# Altium schematic sheet resistors_set.SchDoc
size A4; SheetNumber: 2; SheetTotal: 6
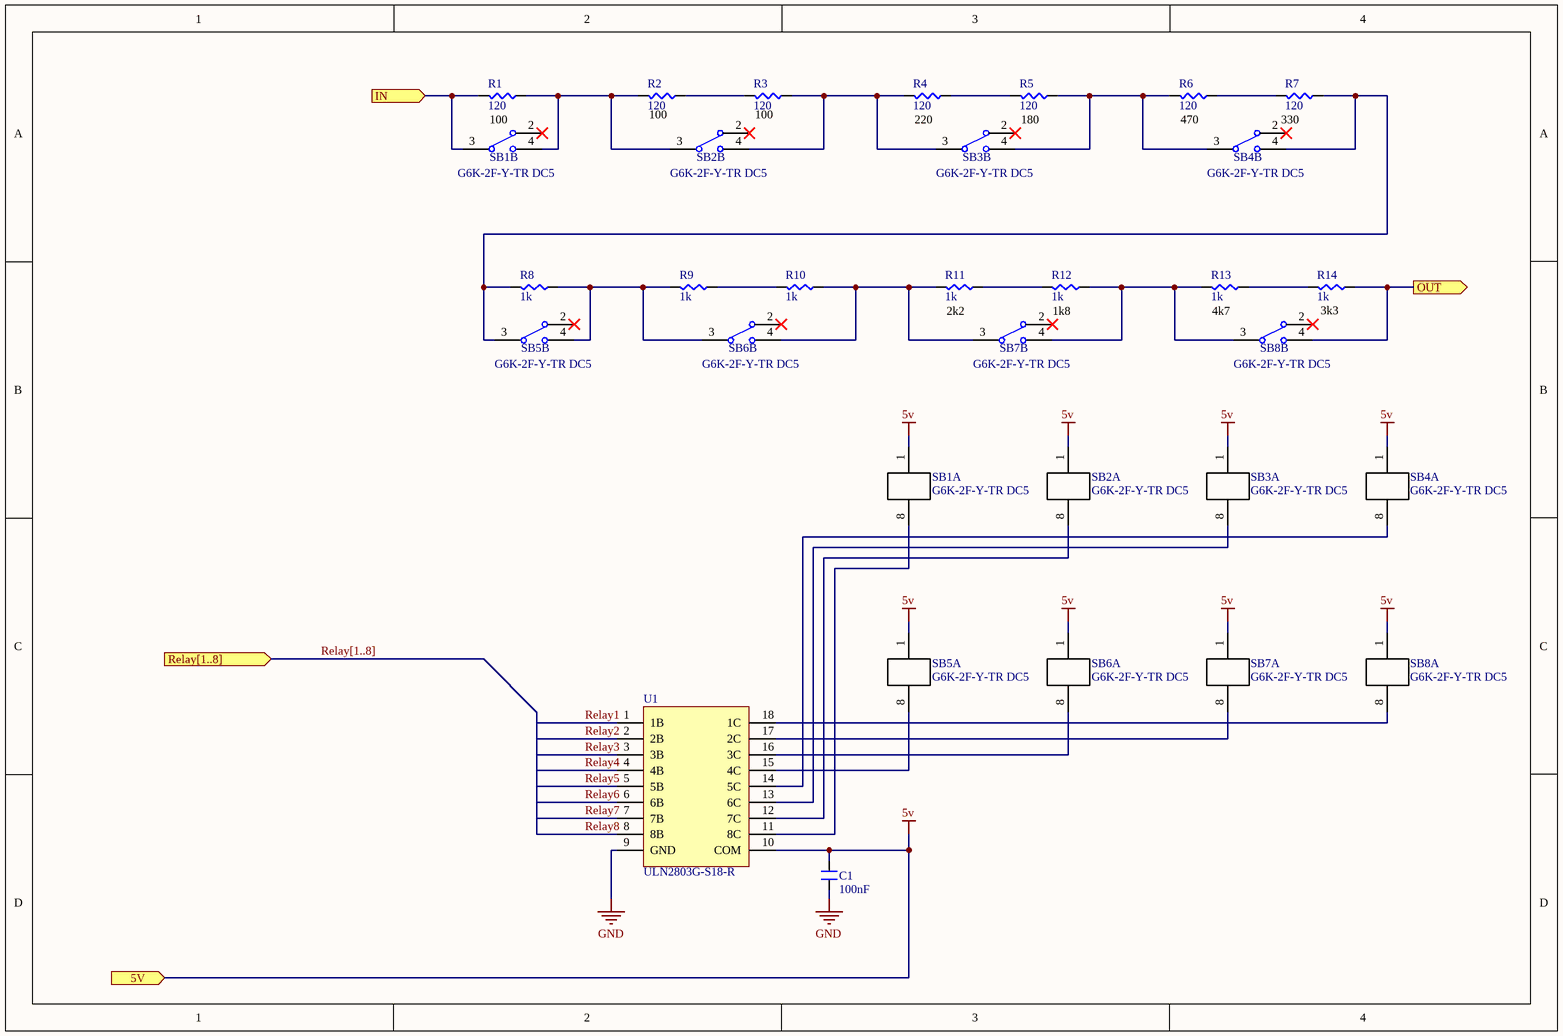
[diagram p0: resistors_set.SchDoc]

## Parts
C1  100nF  [CAP0603]
R1  120  [RES1206]
R2  120  [RES1206]
R3  120  [RES1206]
R4  120  [RES1206]
R5  120  [RES1206]
R6  120  [RES1206]
R7  120  [RES1206]
R8  1k  [RES1206]
R9  1k  [RES1206]
R10  1k  [RES1206]
R11  1k  [RES1206]
R12  1k  [RES1206]
R13  1k  [RES1206]
R14  1k  [RES1206]
SB1  G6K-2F-Y-TR DC5  [Omron_G6K-2F-Y]  (parts A,B of 3)
SB2  G6K-2F-Y-TR DC5  [Omron_G6K-2F-Y]  (parts A,B of 3)
SB3  G6K-2F-Y-TR DC5  [Omron_G6K-2F-Y]  (parts A,B of 3)
SB4  G6K-2F-Y-TR DC5  [Omron_G6K-2F-Y]  (parts A,B of 3)
SB5  G6K-2F-Y-TR DC5  [Omron_G6K-2F-Y]  (parts A,B of 3)
SB6  G6K-2F-Y-TR DC5  [Omron_G6K-2F-Y]  (parts A,B of 3)
SB7  G6K-2F-Y-TR DC5  [Omron_G6K-2F-Y]  (parts A,B of 3)
SB8  G6K-2F-Y-TR DC5  [Omron_G6K-2F-Y]  (parts A,B of 3)
U1  ULN2803G-S18-R  [SOIC-18-wide]

## Ports
5V (in), IN (in), OUT (out), Relay[1..8] (in)

## Nets
5v: C1.2 SB1.1 SB2.1 SB3.1 SB4.1 SB5.1 SB6.1 SB7.1 SB8.1 U1.10(COM) ; port 5V
GND: C1.1 U1.9(GND)
IN: R1.1 SB1.3 ; port IN
OUT: R14.2 SB8.4 ; port OUT
Relay1: U1.1(1B)
Relay2: U1.2(2B)
Relay3: U1.3(3B)
Relay4: U1.4(4B)
Relay5: U1.5(5B)
Relay6: U1.6(6B)
Relay7: U1.7(7B)
Relay8: U1.8(8B)
NetR1_2: R1.2 R2.1 SB1.4 SB2.3
NetR2_2: R2.2 R3.1
NetR3_2: R3.2 R4.1 SB2.4 SB3.3
NetR4_2: R4.2 R5.1
NetR5_2: R5.2 R6.1 SB3.4 SB4.3
NetR6_2: R6.2 R7.1
NetR7_2: R7.2 R8.1 SB4.4 SB5.3
NetR8_2: R8.2 R9.1 SB5.4 SB6.3
NetR9_2: R9.2 R10.1
NetR10_2: R10.2 R11.1 SB6.4 SB7.3
NetR11_2: R11.2 R12.1
NetR12_2: R12.2 R13.1 SB7.4 SB8.3
NetR13_2: R13.2 R14.1
NetSB1_8: SB1.8 U1.11(8C)
NetSB2_8: SB2.8 U1.12(7C)
NetSB3_8: SB3.8 U1.13(6C)
NetSB4_8: SB4.8 U1.14(5C)
NetSB5_8: SB5.8 U1.15(4C)
NetSB6_8: SB6.8 U1.16(3C)
NetSB7_8: SB7.8 U1.17(2C)
NetSB8_8: SB8.8 U1.18(1C)

Not connected (* = marked no-connect by the designer): SB1 2*; SB2 2*; SB3 2*; SB4 2*; SB5 2*; SB6 2*; SB7 2*; SB8 2*

## Buses and harness runs
bus Relay[1..8] = port Relay[1..8]

## Notes on the sheet
- (near SB1) 100
- (near R2) 100
- (near R3) 100
- 220
- (near R5) 180
- (near R6) 470
- 330
- (near R11) 2k2
- 1k8
- 4k7
- (near R14) 3k3

## Library data of the parts
C1 = GCM188R71H104KA57J: Tolerance ±10% / Rated Voltage 50Vdc / Temperature 0±30ppm/℃; Manufacturer: Arrow Electronics; Item: 100nF 50V  ±10%; Vdc: 50V; Part Number: GCM188R71H104KA57J; Supplier 1: Mouser; Supplier Part Number 1: 81-GCM188R71H104KA7J; Case: 0603; Tolerance: 10%; Value: 100nF; HelpURL: http://www.farnell.com/datasheets/4360.pdf?src-supplier=Element14; Category: Multilayer Ceramic Capacitors - SMD/SMT
R1-R7 = CR1206-FX-1200ELF: Tolerance ±1% / Power (Watts) 0.25W, 1/4W / Temperature Coefficient ±100ppm/°C; Manufacturer: Bourns; Item: 120 ±1% 0.25W; Part Number: CR1206-FX-1200ELF; Supplier 1: Mouser; Supplier Part Number 1: 652-CR1206FX-1200ELF; Case: 1206; Tolerance: 1%; Value: 120; HelpURL: https://eu.mouser.com/datasheet/2/54/cr-1858361.pdf; Category: Thin Film Resistors - SMD
R8-R14 = CRT1206-FZ-1001ELF: Tolerance ±1% / Power (Watts) 0.1W, 1/10W / Temperature Coefficient ±50ppm/°C; Manufacturer: Bourns; Item: 1k ±1% 0.25W; Part Number: CRT1206-FZ-1001ELF; Supplier 1: Mouser; Supplier Part Number 1: 652-CRT1206FZ1001ELF; Case: 1206; Tolerance: 1%; Value: 1k; HelpURL: https://eu.mouser.com/datasheet/2/54/CRT-1649066.pdf; Category: Thin Film Resistors - SMD
SB1-SB8 = G6K-2F-Y-TR DC5: 1A 5V DPDT (2 Form C) SMD,6.5x10mm Signal Relays ROHS; Manufacturer: Omron Electronics; Part Number: G6K-2F-Y-TR DC5; Item: G6K-2F-Y-TR DC5; Supplier: LCSC; Supplier Part Number 1: C47190; Mechanical Life: N/A; Switch Function: DPDT (2 Form C); Vdss: 5V; Case: SMD,6.5x10mm; HelpURL: https://www.lcsc.com/datasheet/lcsc_datasheet_2211282300_Omron-Electronics-G6K-2F-Y-TR-DC5_C47190.pdf; Category: Relays/Signal Relays
U1 = ULN2803G-S18-R: SOP-18 Darlington Transistor Arrays ROHS; Manufacturer: UTC(Unisonic Tech); Channel: NPN; Vds: 50B; Id: 500mA; Part Number: ULN2803G-S18-R; Item: ULN2803; Supplier 1: LCSC; Supplier Part Number 1: C33924; Case: SOP-18; HelpURL: https://www.lcsc.com/datasheet/lcsc_datasheet_1810241824_UTC-Unisonic-Tech-ULN2803G-S18-R_C33924.pdf; Category: Transistors/Thyristors/Darlington Transistor Arrays